# EAGLE design espthing (EAGLE 9.6.2)
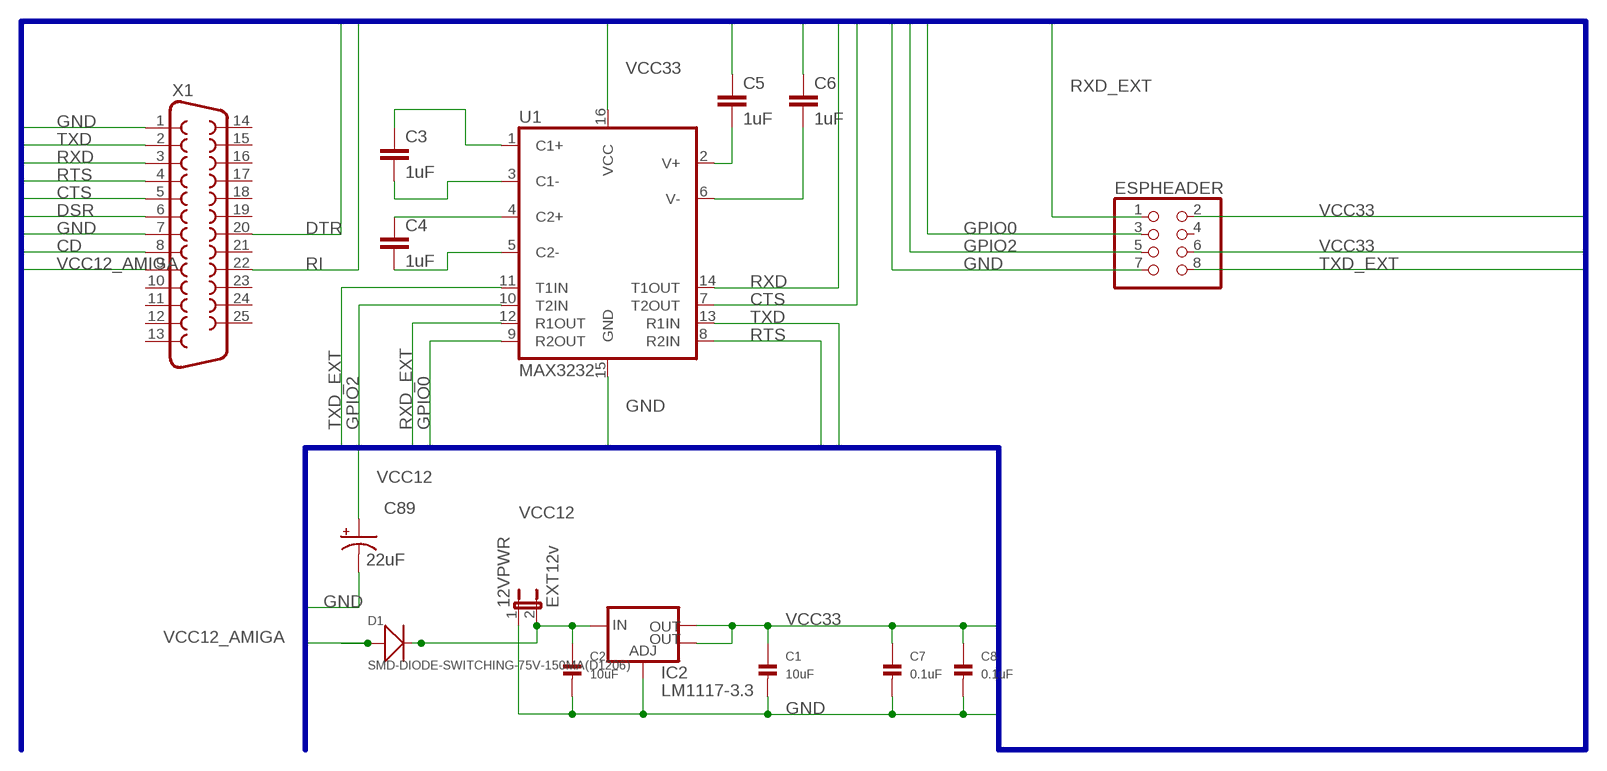
[diagram p0: schematic, sheet 1]

## Parts
12VPWR  EXT12v  JUMPER-2PTH  [1X02]
C1  10uF  CAP_CERAMIC1206  [1206]
C2  10uF  CAP_CERAMIC1206  [1206]
C3  1uF  C-EUC1206  [C1206]
C4  1uF  C-EUC1206  [C1206]
C5  1uF  C-EUC1206  [C1206]
C6  1uF  C-EUC1206  [C1206]
C7  0.1uF  CAP_CERAMIC1206  [1206]
C8  0.1uF  CAP_CERAMIC1206  [1206]
C89  22uF  CPOL-USB  [PANASONIC_B]
D1  SMD-DIODE-SWITCHING-75V-150MA(D1206)  [LED-1206]
ESPHEADER  PINHD-2X4  [2X04]
IC2  LM1117-3.3  V_REG_LM1117SOT223  [SOT223]
U1  MAX3232  MAX2323SOIC16  [SO16]
X1  DB25_FEMALEHP  [F25HP]

## Nets
CD: X1.8
CTS: U1.7(T2OUT) X1.5
DSR: X1.6
DTR: X1.20
GND: 12VPWR.1 C1.2 C2.2 C5.1 C6.1 C7.2 C8.2 C89.- ESPHEADER.7 IC2.1(ADJ) U1.15(GND) X1.1 X1.7
GPIO0: ESPHEADER.3 U1.9(R2OUT)
GPIO2: ESPHEADER.5 U1.10(T2IN)
N$1: C3.1 U1.1(C1+)
N$2: C3.2 U1.3(C1-)
N$3: C4.1 U1.4(C2+)
N$4: C4.2 U1.5(C2-)
N$5: C5.2 U1.2(V+)
N$6: C6.2 U1.6(V-)
RI: X1.22
RTS: U1.8(R2IN) X1.4
RXD: U1.14(T1OUT) X1.3
RXD_EXT: ESPHEADER.1 U1.12(R1OUT)
TXD: U1.13(R1IN) X1.2
TXD_EXT: ESPHEADER.8 U1.11(T1IN)
VCC12: 12VPWR.2 C2.1 C89.+ D1.- IC2.3(IN)
VCC12_AMIGA: D1.+ X1.9
VCC33: C1.1 C7.1 C8.1 ESPHEADER.2 ESPHEADER.6 IC2.2(OUT) IC2.4(OUT) U1.16(VCC)
Unconnected: ESPHEADER.4 X1.10 X1.11 X1.12 X1.13 X1.14 X1.15 X1.16 X1.17 X1.18 X1.19 X1.21 X1.23 X1.24 X1.25

## Buses
CD,CTS,DSR,DTR,GND,GPIO[0..2],RI,RTS,RXD,RXD_EXT,TXD,TXD_EXT,VCC12,VCC12_AMIGA,VCC33

## Library data of the parts
12VPWR = SparkFun-Retired:JUMPER-2: Jumper Basic 0.1" spaced jumper. Use with breakaway headers.
C1 C2 C7 C8 = microbuilder:CAP_CERAMIC: Ceramic Capacitors 0402 - 0402 Surface Mount Capacitors 16pF 50V 5% [Digikey: 445-4899-2-ND] 18pF 50V 5% [Digikey: 490-1281-2-ND] 22pF 50V 5% [Digikey: 490-1283-2-ND] 68pF 50V 5% [Digikey: 490-1289-2-ND] 0.1uF 10V 10% [Digikey: 490-1318-2-ND] 1.0uF 6.3V 10% [Digikey: 490-1320-2-ND] 0603 - 0603 Surface Mount Capacitors 16 pF 50V 5% [Digikey: 445-5051-2-ND] 22 pF 50V [Digikey: PCC220ACVTR-ND] 33 pF 50V 5% [Digikey: 490-1415-1-ND] 56pF 50V 5% [Digikey: 490-1421-1-ND] 220pF 50V 5% [Digikey: 445-1285-1-ND] 680 pF 50V 2200 pF 50V 5% C0G [Digikey: 445-1297-1-ND] 5600 pF 100V 5% X7R [Digikey: 478-3711-1-ND] 0.1 µF 25V 10% [Digikey: PCC2277TR-ND] 0.22 µF 16V 10% X7R [Digikey: 445-1318-1-ND] 1.0 µF 25V 10% [Digikey: 445-5146-2-ND] 0603 - RF Specific 3pF 250V +/-0.1pF RF [Digikey: 712-1347-1-ND] 18 pF 250V 5% [Digikey: 478-3505-1-ND or 712-1322-1-ND] 56 pF 250V 5% C0G RF [Digikey: 490-4867-1-ND] 68 pF 250V RF [Digikey: 490-4868-1-ND] 0805 - 0805 Surface Mount Capacitors 220 pF 250V 2% RF Ceramic Capacitor [Digikey: 712-1398-1-ND] 1000 pF 50V 2% NP0 Ceramic Capacitor [Digikey: 478-3760-1-ND] 0.1 µF 25V 10% Ceramic Capacitor [Digikey: PCC1828TR-ND] 1.0 µF 16V 10% Ceramic Capacitor[Digikey: 490-1691-2-ND] 10.0 µF 10V 10% Ceramic Capacitor[Digikey: 709-1228-1-ND] 10.0 uF 16V 10% Ceramic Capacitor [Digikey: 478-5165-2-ND] 47 uF 6.3V 20% Ceramic Capacitor [Digikey: 587-1779-1-ND or 399-5506-1-ND] 1206 - 1206 Surface Mount Capacitors 47uF 10V 20% Ceramic Capacitor [Digikey: 490-5528-1-ND or 399-5508-1-ND or 445-6010-1-ND] 100uF 6.3V -20%, +80% Y5V Ceramic Capacitor (Digikey: 490-4512-1-ND, Mouser: 81-GRM31CF50J107ZE1L)
C3-C6 = rcl:C-EU: CAPACITOR, European symbol; SPICEPREFIX: C
C89 = adafruit:CPOL-US: POLARIZED CAPACITOR, American symbol
D1 = SMD-DIODE-SWITCHING-75V-150MA_D1206_:SMD-DIODE-SWITCHING-75V-150MA(D1206): 304040005 Check availability <https://pricing.snapeda.com/parts/CD1206-S01575/Bourns/view-part?ref=eda>; AVAILABILITY: In Stock; CHECK_PRICES: https://www.snapeda.com/parts/CD1206-S01575/Bourns+-+J.W.+Miller/view-part/?ref=eda; DESCRIPTION: CD1206-S01575, SMT Switching Diode, 100V 150mA, 4ns, 2-Pin 1206 | Bourns CD1206-S01575; MF: Bourns; MP: CD1206-S01575; PACKAGE: 1206 Bourns; PRICE: None; PURCHASE-URL: https://www.snapeda.com/api/url_track_click_mouser/?unipart_id=42622&manufacturer=Bourns&part_name=CD1206-S01575&search_term=None; SNAPEDA_LINK: https://www.snapeda.com/parts/CD1206-S01575/Bourns+-+J.W.+Miller/view-part/?ref=snap
ESPHEADER = pinhead:PINHD-2X4: PIN HEADER
IC2 = SparkFun-PowerIC:V_REG_LM1117: Voltage Regulator LM1117 Standard adjustable voltage regulator but in SMD form. Spark Fun Electronics SKU : COM-00595; PROD_ID: VREG-08170
U1 = SparkFun-IC-Comms:MAX2323: RS232 Transceiver This part covers 232 drivers that are compatible with the MAX3232. Sipex SP3232EB Datasheet <http://cdn.sparkfun.com/datasheets/Components/General%20IC/SP3232EBCA-L.pdf> SparkFun Products SOIC component <https://www.sparkfun.com/products/589> (COM-00589 / IC-08171) Retired DIP component (COM-00316 / IC-08446) SparkFun Transceiver Breakout - MAX3232 <https://www.sparkfun.com/products/11189> (BOB-11189) SparkFun XBee Explorer Serial <https://www.sparkfun.com/products/13225> (WRL-13225); PROD_ID: IC-08171
X1 = SparkFun-Retired:DB25_FEMALE: 25 Pin male connector. PCB edge mount for regular PCB thicknesses. This connector will connect directly to the back of a PC parallel port or through a normal DB25 extension cable (M/F). SKU: PRT-08287

## Net classes
0 default: width 0.152 mm, drill 0.3 mm, clearance 0.152 mm

## Board
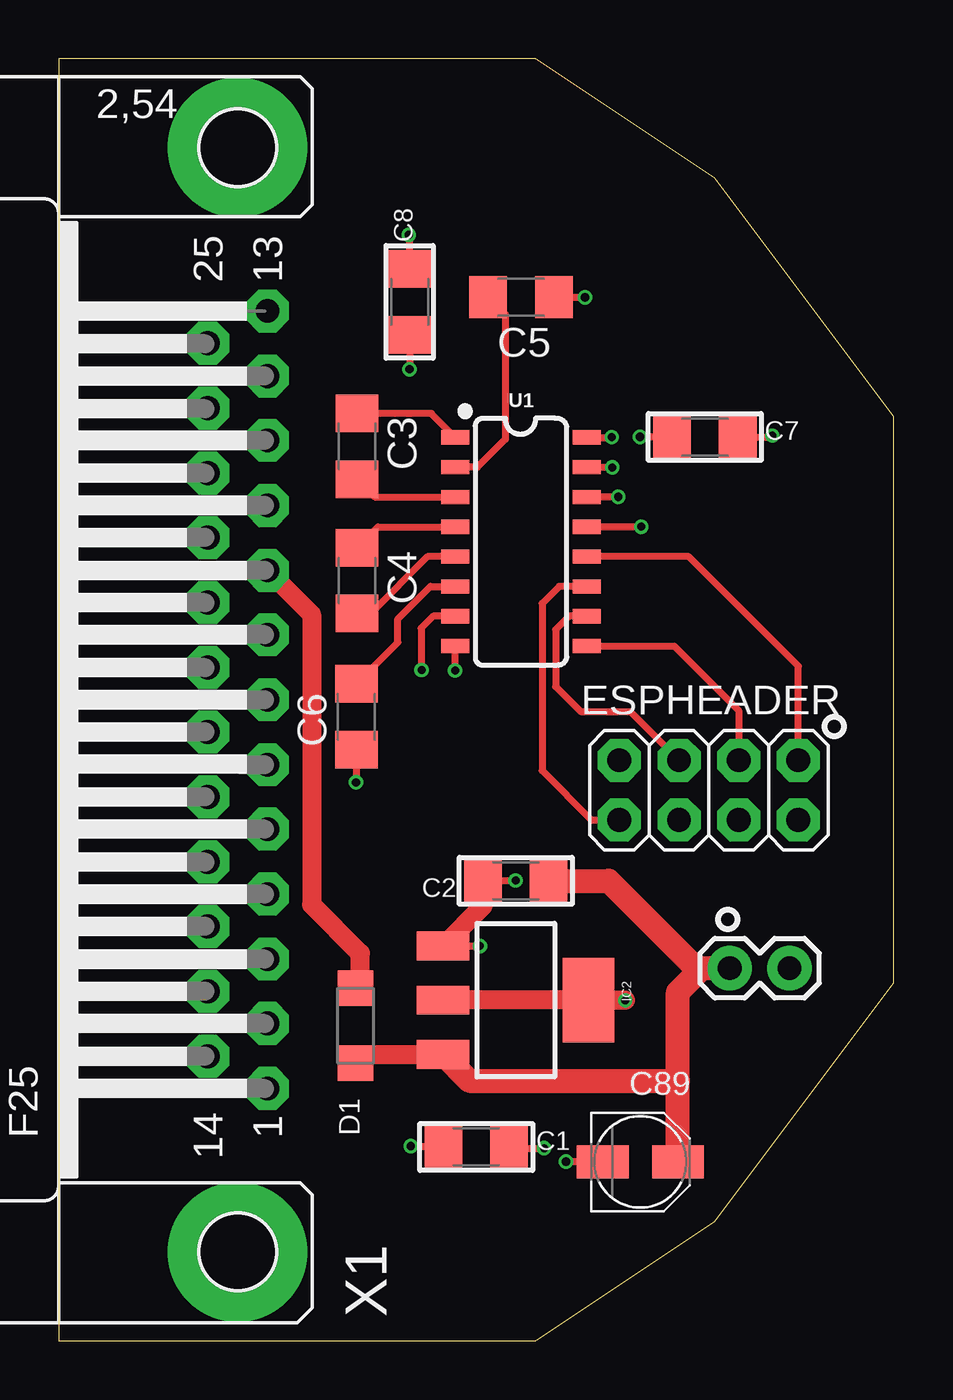
[diagram p1: board, top side]
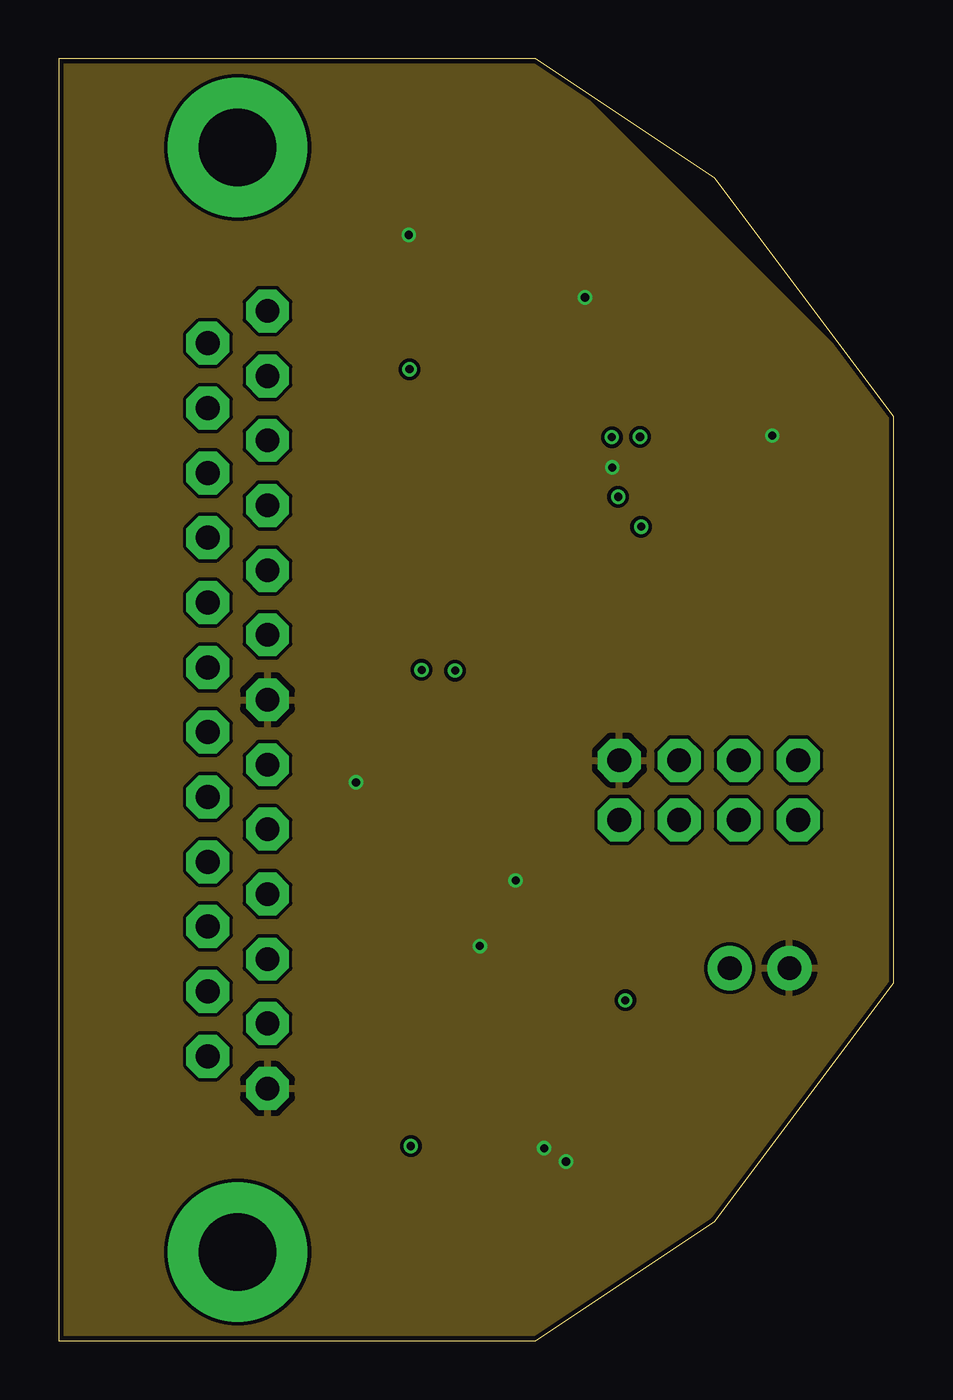
[diagram p2: board, inner layer Route2]
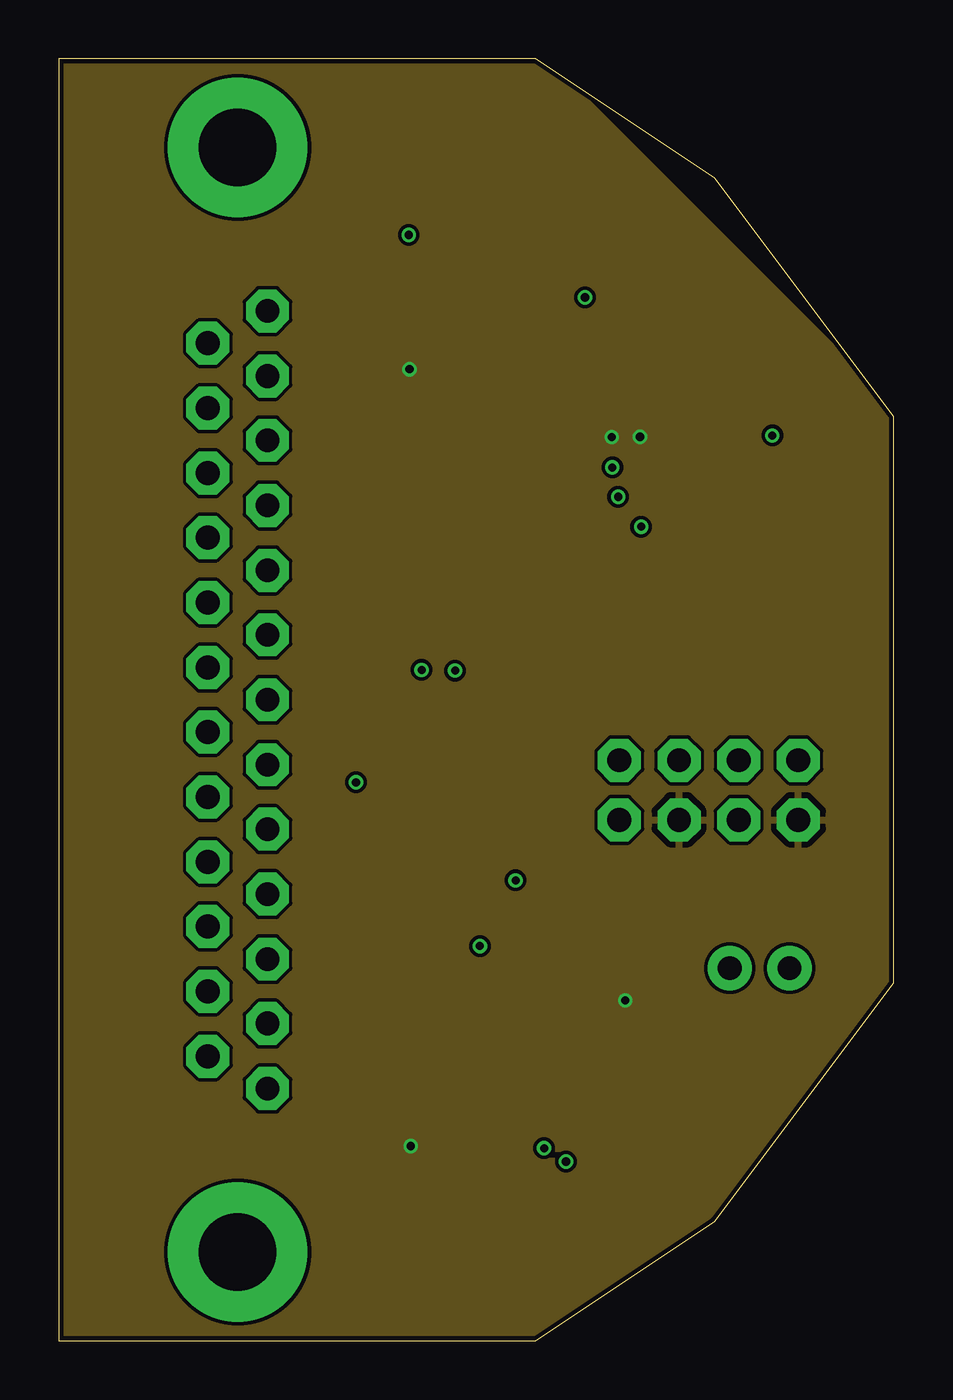
[diagram p3: board, inner layer Route15]
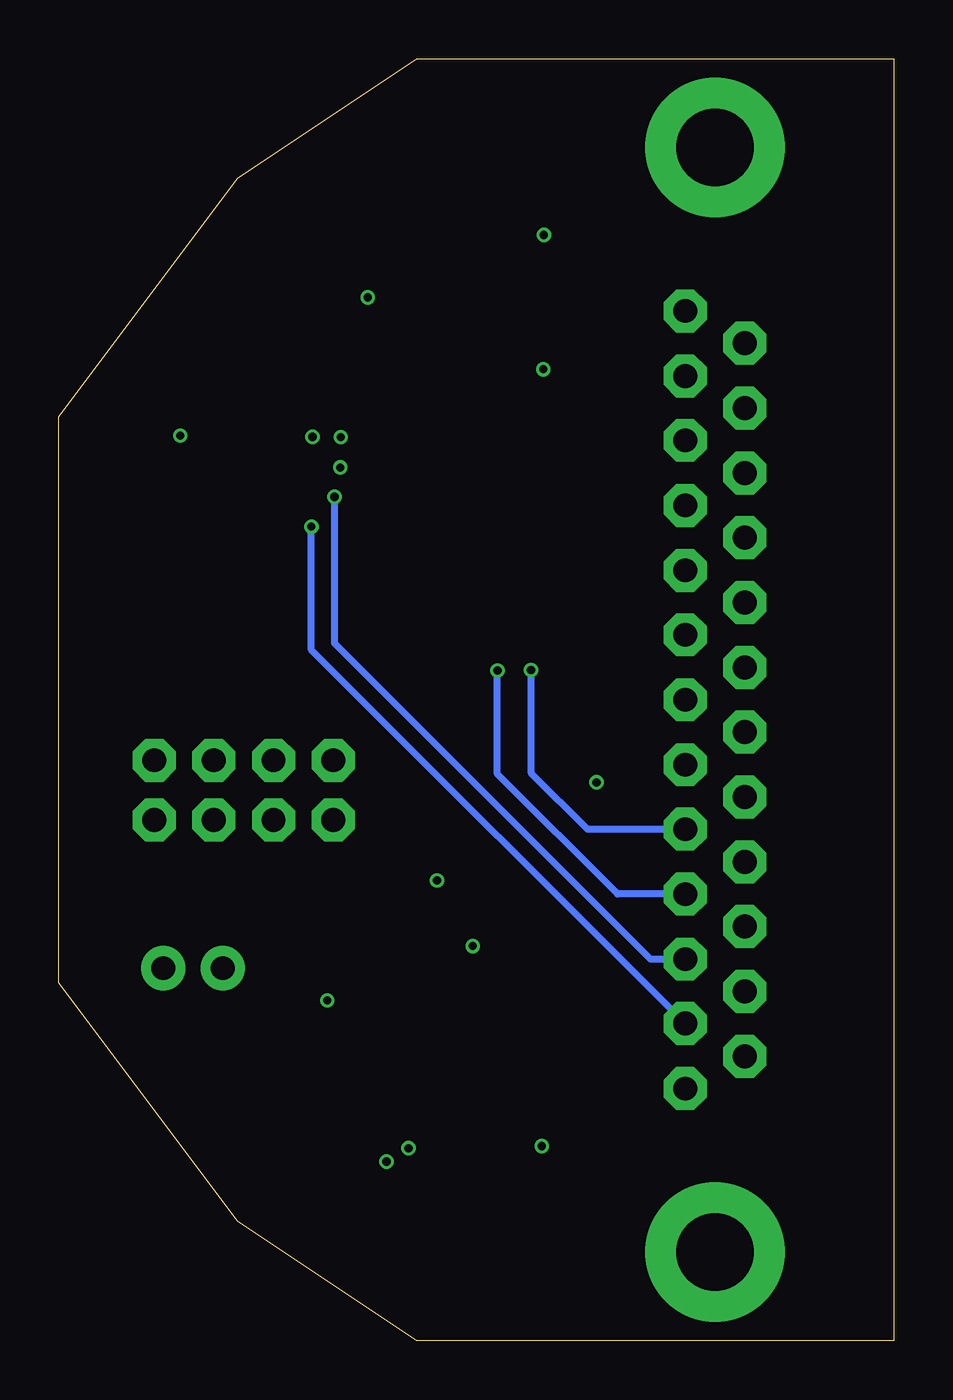
[diagram p4: board, bottom side, seen from below]

Size 35.56 x 54.61 mm. Coordinates in mm from the lower left corner, seen from the top.
Outline: 0,0 20.32,0 27.94,5.08 35.56,15.24 35.56,39.37 27.94,49.53 20.32,54.61 0,54.61 0,0
Copper layers (1+2*15+16): Top 0.035mm / dielectric 0.2mm / Route2 0.0175mm / dielectric 1.065mm / Route15 0.0175mm / dielectric 0.2mm / Bottom 0.035mm
Design rules "jlcpcb-4layers": minimum track width 3.5mil, minimum drill 0.2mm, track to track 5mil, track to pad 0.2mm, pad to pad 5mil, via to via 0.5mm, smd to smd 5mil, copper to edge 0.2mm, drill to drill 6mil, minimum pad ring 10mil, minimum via ring 0.13mm, stop-mask expansion 0.05mm, vias tented up to drill 16mil, thermal gap 10mil

### Footprints (pad centres in the part's own frame; a part is rotated, then mirrored left to right if it is on the bottom)
1X02 = drill 1.016 pad 1.88: 1 0,0; 2 2.54,0
1206 = smd 1.6 x 1.8: 1 -1.4,0; 2 1.4,0
C1206 = smd 1.6 x 1.8: 1 -1.4,0; 2 1.4,0
PANASONIC_B = smd 2.2 x 1.4: + 1.6,0; - -1.6,0
LED-1206 = smd 1.5 x 1.5: + -1.6,0; - 1.6,0
2X04 = drill 1.016 octagon: 1 -3.81,-1.27; 2 -3.81,1.27; 3 -1.27,-1.27; 4 -1.27,1.27; 5 1.27,-1.27; 6 1.27,1.27; 7 3.81,-1.27; 8 3.81,1.27
SOT223 = smd 1.219 x 2.235: 1 -2.311,-3.099; 2 0,-3.099; 3 2.311,-3.099 | smd 3.6 x 2.2: 4 0,3.099
SO16 = smd 0.6 x 1.2: 1 -4.445,-2.8; 2 -3.175,-2.8; 3 -1.905,-2.8; 4 -0.635,-2.8; 5 0.635,-2.8; 6 1.905,-2.8; 7 3.175,-2.8; 8 4.445,-2.8; 9 4.445,2.8; 10 3.175,2.8; 11 1.905,2.8; 12 0.635,2.8; 13 -0.635,2.8; 14 -1.905,2.8; 15 -3.175,2.8; 16 -4.445,2.8
F25HP = drill 1.016 octagon: 1 -16.561,-1.27; 2 -13.792,-1.27; 3 -11.049,-1.27; 4 -8.28,-1.27; 5 -5.512,-1.27; 6 -2.769,-1.27; 7 0,-1.27; 8 2.769,-1.27; 9 5.512,-1.27; 10 8.28,-1.27; 11 11.049,-1.27; 12 13.792,-1.27; 13 16.561,-1.27; 14 -15.189,1.27; 15 -12.421,1.27; 16 -9.652,1.27; 17 -6.909,1.27; 18 -4.14,1.27; 19 -1.372,1.27; 20 1.372,1.27; 21 4.14,1.27; 22 6.909,1.27; 23 9.652,1.27; 24 12.421,1.27; 25 15.189,1.27 | drill 3.302 pad 5.08: G1 -23.52,0; G2 23.52,0

### Placement (x,y rotation side)
12VPWR  31.11,15.88 180 top
C1  17.78,8.26 0 top
C2  19.46,19.59 180 top
C3  12.7,38.1 270 top
C4  12.7,32.38 270 top
C5  19.68,44.45 180 top
C6  12.67,26.58 90 top
C7  27.51,38.5 0 top
C8  14.94,44.25 90 top
C89  24.77,7.62 0 top
D1  12.63,13.42 270 top
ESPHEADER  27.68,23.46 180 top
IC2  19.46,14.51 270 top
U1  19.68,34.04 270 top
X1  7.62,27.3 90 top

### Tracks (layer width: path | path; a pad name or v marks a point on that pad's centre or on a via)
CTS  (via drill 0.35)
  Top 0.305: U1.7 15.94,30.86 15.43,30.35 15.43,28.6 v15.45,28.57
  Bottom 0.305: v15.45,28.57 15.45,24.19 13.05,21.79 X1.5
GND  (via drill 0.35)
  Top 0.305: C5.1 22.4,44.45 v22.41,44.44 | U1.15 v23.56,37.21 v23.57,37.2 | IC2.1 v17.93,16.82 | C2.2 18.08,19.61 v19.45,19.61 | C6.1 12.68,23.8 v12.66,23.79 | C1.2 19.23,8.2 v20.67,8.2 | C89.- 21.61,7.62 v21.6,7.63 | C7.2 30.33,38.5 v30.38,38.56 | C8.2 14.94,47.06 v14.9,47.1
  Top 0.813: C2.2 18.06,18.52 IC2.1
  pour Route2: 0,54.61 20.66,54.61 35.77,39.5 35.77,13.24 22.38,-0.16 0.05,-0.16 0.05,54.58 0.06,54.59
GPIO0
  Top 0.305: U1.9 26.21,29.59 28.95,26.85 ESPHEADER.3
GPIO2
  Top 0.305: U1.10 21.73,30.86 21.16,30.29 21.16,27.87 22.23,26.8 24.34,26.8 ESPHEADER.5
N$1
  Top 0.305: U1.1 15.87,39.5 C3.1
N$2
  Top 0.305: C3.2 13.46,35.94 U1.3
N$3
  Top 0.305: C4.1 13.59,34.67 U1.4
N$4
  Top 0.305: U1.5 15.7,33.4 13.28,30.98 C4.2
N$5
  Top 0.305: C5.2 19.02,43.72 19.02,38.4 17.83,37.21 U1.2
N$6
  Top 0.305: C6.2 14.44,29.75 14.44,30.75 15.83,32.13 U1.6
RTS  (via drill 0.35)
  Top 0.305: v16.88,28.55 U1.8
  Bottom 0.305: X1.4 11.76,19.02 16.88,24.14 v16.88,28.55
RXD  (via drill 0.35)
  Top 0.305: U1.14 22.49,35.95 v23.82,35.95
  Bottom 0.305: v23.82,35.95 23.82,29.71 10.37,16.26 X1.3
RXD_EXT
  Top 0.305: U1.12 26.83,33.4 31.49,28.74 ESPHEADER.1
TXD  (via drill 0.35)
  Top 0.305: v24.8,34.68 v24.8,34.67 U1.13
  Bottom 0.305: X1.2 24.8,29.42 v24.8,34.68
TXD_EXT
  Top 0.305: U1.11 21.3,32.13 20.58,31.41 20.58,24.29 22.68,22.19 ESPHEADER.8
VCC12
  Top 0.813: D1.- 13.01,12.2 IC2.3
  Top 1.016: C2.1 23.42,19.59 27.13,15.88 12VPWR.2 27.39,15.88 26.36,14.85 26.36,11.08 | C89.+ 26.36,11.08 | IC2.3 17.48,11.08 26.36,11.08
VCC12_AMIGA
  Top 0.813: X1.9 10.77,30.94 10.77,18.58 12.85,16.5 12.85,15.24 D1.+
VCC33  (via drill 0.35)
  Top 0.305: U1.16 23.54,38.48 v23.55,38.49 | C1.1 15.03,8.26 v14.99,8.29 | C7.1 v24.76,38.5 v24.75,38.51 | C8.1 14.94,41.39 v14.93,41.38
  Top 0.813: IC2.2 IC2.4 v24.11,14.51 v24.12,14.5
  pour Route15: 0,54.61 20.66,54.61 35.77,39.5 35.77,13.24 22.38,-0.16 0.05,-0.16 0.05,54.58 0.06,54.59